# Altium schematic sheet Debug.SchDoc: Debug
size B; DrawnBy: Jasper Yun; SheetNumber: 11; SheetTotal: 11; Competition: SAC 2021; Subteam: Avionics; University: McGill University; Location: Montreal, Quebec; Project: Avionics Project Name; MRT: McGill Rocket Team
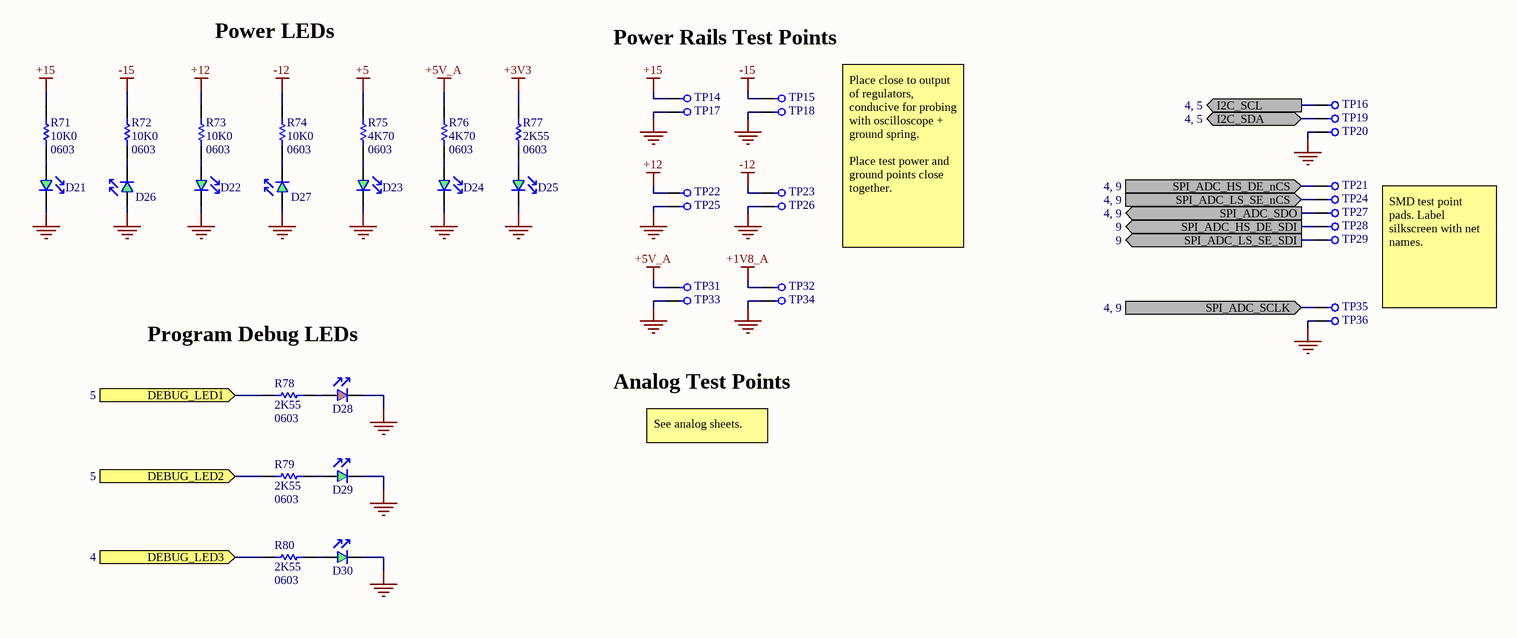
[diagram p0: Debug.SchDoc]

## Parts
D21  LED Green  [0603 LED]  (value not drawn)
D22  LED Green  [0603 LED]  (value not drawn)
D23  LED Green  [0603 LED]  (value not drawn)
D24  LED Green  [0603 LED]  (value not drawn)
D25  LED Green  [0603 LED]  (value not drawn)
D26  LED Green  [0603 LED]  (value not drawn)
D27  LED Green  [0603 LED]  (value not drawn)
D28  LED Red  [0603 LED]  (value not drawn)
D29  LED Green  [0603 LED]  (value not drawn)
D30  LED Green  [0603 LED]  (value not drawn)
R71  10K0  value 0603  [0603 RES]
R72  10K0  value 0603  [0603 RES]
R73  10K0  value 0603  [0603 RES]
R74  10K0  value 0603  [0603 RES]
R75  4K70  value 0603  [0603 RES]
R76  4K70  value 0603  [0603 RES]
R77  2K55  value 0603  [0603 RES]
R78  2K55  value 0603  [0603 RES]
R79  2K55  value 0603  [0603 RES]
R80  2K55  value 0603  [0603 RES]
TP14  Test Point  [Test Point Keystone 5015]  (value not drawn)
TP15  Test Point  [Test Point Keystone 5015]  (value not drawn)
TP16  Test Point  [TEST POINT SMD PAD]  (value not drawn)  (no BOM)
TP17  Test Point  [Test Point Keystone 5015]  (value not drawn)
TP18  Test Point  [Test Point Keystone 5015]  (value not drawn)
TP19  Test Point  [TEST POINT SMD PAD]  (value not drawn)  (no BOM)
TP20  Test Point  [TEST POINT SMD PAD]  (value not drawn)  (no BOM)
TP21  Test Point  [TEST POINT SMD PAD]  (value not drawn)  (no BOM)
TP22  Test Point  [Test Point Keystone 5015]  (value not drawn)
TP23  Test Point  [Test Point Keystone 5015]  (value not drawn)
TP24  Test Point  [TEST POINT SMD PAD]  (value not drawn)  (no BOM)
TP25  Test Point  [Test Point Keystone 5015]  (value not drawn)
TP26  Test Point  [Test Point Keystone 5015]  (value not drawn)
TP27  Test Point  [TEST POINT SMD PAD]  (value not drawn)  (no BOM)
TP28  Test Point  [TEST POINT SMD PAD]  (value not drawn)  (no BOM)
TP29  Test Point  [TEST POINT SMD PAD]  (value not drawn)  (no BOM)
TP31  Test Point  [Test Point Keystone 5015]  (value not drawn)
TP32  Test Point  [Test Point Keystone 5015]  (value not drawn)
TP33  Test Point  [Test Point Keystone 5015]  (value not drawn)
TP34  Test Point  [Test Point Keystone 5015]  (value not drawn)
TP35  Test Point  [TEST POINT SMD PAD]  (value not drawn)  (no BOM)
TP36  Test Point  [TEST POINT SMD PAD]  (value not drawn)  (no BOM)

## Ports
DEBUG_LED1 (in, see 5), DEBUG_LED2 (in, see 5), DEBUG_LED3 (in, see 4), I2C_SCL (out, see 4, 5), I2C_SDA (bidir, see 4, 5), SPI_ADC_HS_DE_nCS (in, see 4, 9), SPI_ADC_HS_DE_SDI (out, see 9), SPI_ADC_LS_SE_nCS (in, see 4, 9), SPI_ADC_LS_SE_SDI (out, see 9), SPI_ADC_SCLK (in, see 4, 9), SPI_ADC_SDO (out, see 4, 9)

## Nets
+1V8_A: TP32.1
+3V3: R77.2
+5: R75.2
+5V_A: R76.2 TP31.1
+12: R73.2 TP22.1
+15: R71.2 TP14.1
-12: R74.2 TP23.1
-15: R72.2 TP15.1
GND: D21.2(Cathode) D22.2(Cathode) D23.2(Cathode) D24.2(Cathode) D25.2(Cathode) D26.1(Anode) D27.1(Anode) D28.2(Cathode) D29.2(Cathode) D30.2(Cathode) TP17.1 TP18.1 TP20.1 TP25.1 TP26.1 TP33.1 TP34.1 TP36.1
DEBUG_LED1: R78.2 ; port DEBUG_LED1
DEBUG_LED2: R79.2 ; port DEBUG_LED2
DEBUG_LED3: R80.2 ; port DEBUG_LED3
I2C_SCL: TP16.1 ; port I2C_SCL
I2C_SDA: TP19.1 ; port I2C_SDA
SPI_ADC_HS_DE_nCS: TP21.1 ; port SPI_ADC_HS_DE_nCS
SPI_ADC_HS_DE_SDI: TP28.1 ; port SPI_ADC_HS_DE_SDI
SPI_ADC_LS_SE_nCS: TP24.1 ; port SPI_ADC_LS_SE_nCS
SPI_ADC_LS_SE_SDI: TP29.1 ; port SPI_ADC_LS_SE_SDI
SPI_ADC_SCLK: TP35.1 ; port SPI_ADC_SCLK
SPI_ADC_SDO: TP27.1 ; port SPI_ADC_SDO
NetD21_1: D21.1(Anode) R71.1
NetD22_1: D22.1(Anode) R73.1
NetD23_1: D23.1(Anode) R75.1
NetD24_1: D24.1(Anode) R76.1
NetD25_1: D25.1(Anode) R77.1
NetD26_2: D26.2(Cathode) R72.1
NetD27_2: D27.2(Cathode) R74.1
NetD28_1: D28.1(Anode) R78.1
NetD29_1: D29.1(Anode) R79.1
NetD30_1: D30.1(Anode) R80.1

## Notes on the sheet
- Power LEDs
- Power Rails Test Points
- Place close to output of regulators, conducive for probing with oscilloscope + ground spring.
  Place test power and ground points close together.
- SMD test point pads. Label silkscreen with net names.
- Program Debug LEDs
- Analog Test Points
- See analog sheets.
- Title
- Size:
- Date:
- B
- Revision:
- Time:
- Drawn By:
- Sheet
- of
- File:

## Library data of the parts
D21-D27 D29 D30 = LED Green: Generic Green LED
D28 = LED Red: Generic Red LED
R71-R80 = Res1: Resistor; Published: 8-Jun-2000; LatestRevisionDate: 17-Jul-2002; LatestRevisionNote: Re-released for DXP Platform.; PackageReference: AXIAL-0.3; Publisher: Altium Limited; PackageDescription: Axial Device, Thru-Hole; 2 Leads; 0.3 in Pin Spacing
TP14-TP29 TP31-TP36 = Test Point: Keystone 5015 Test point